# EAGLE design Keypad (EAGLE 6.5.0)
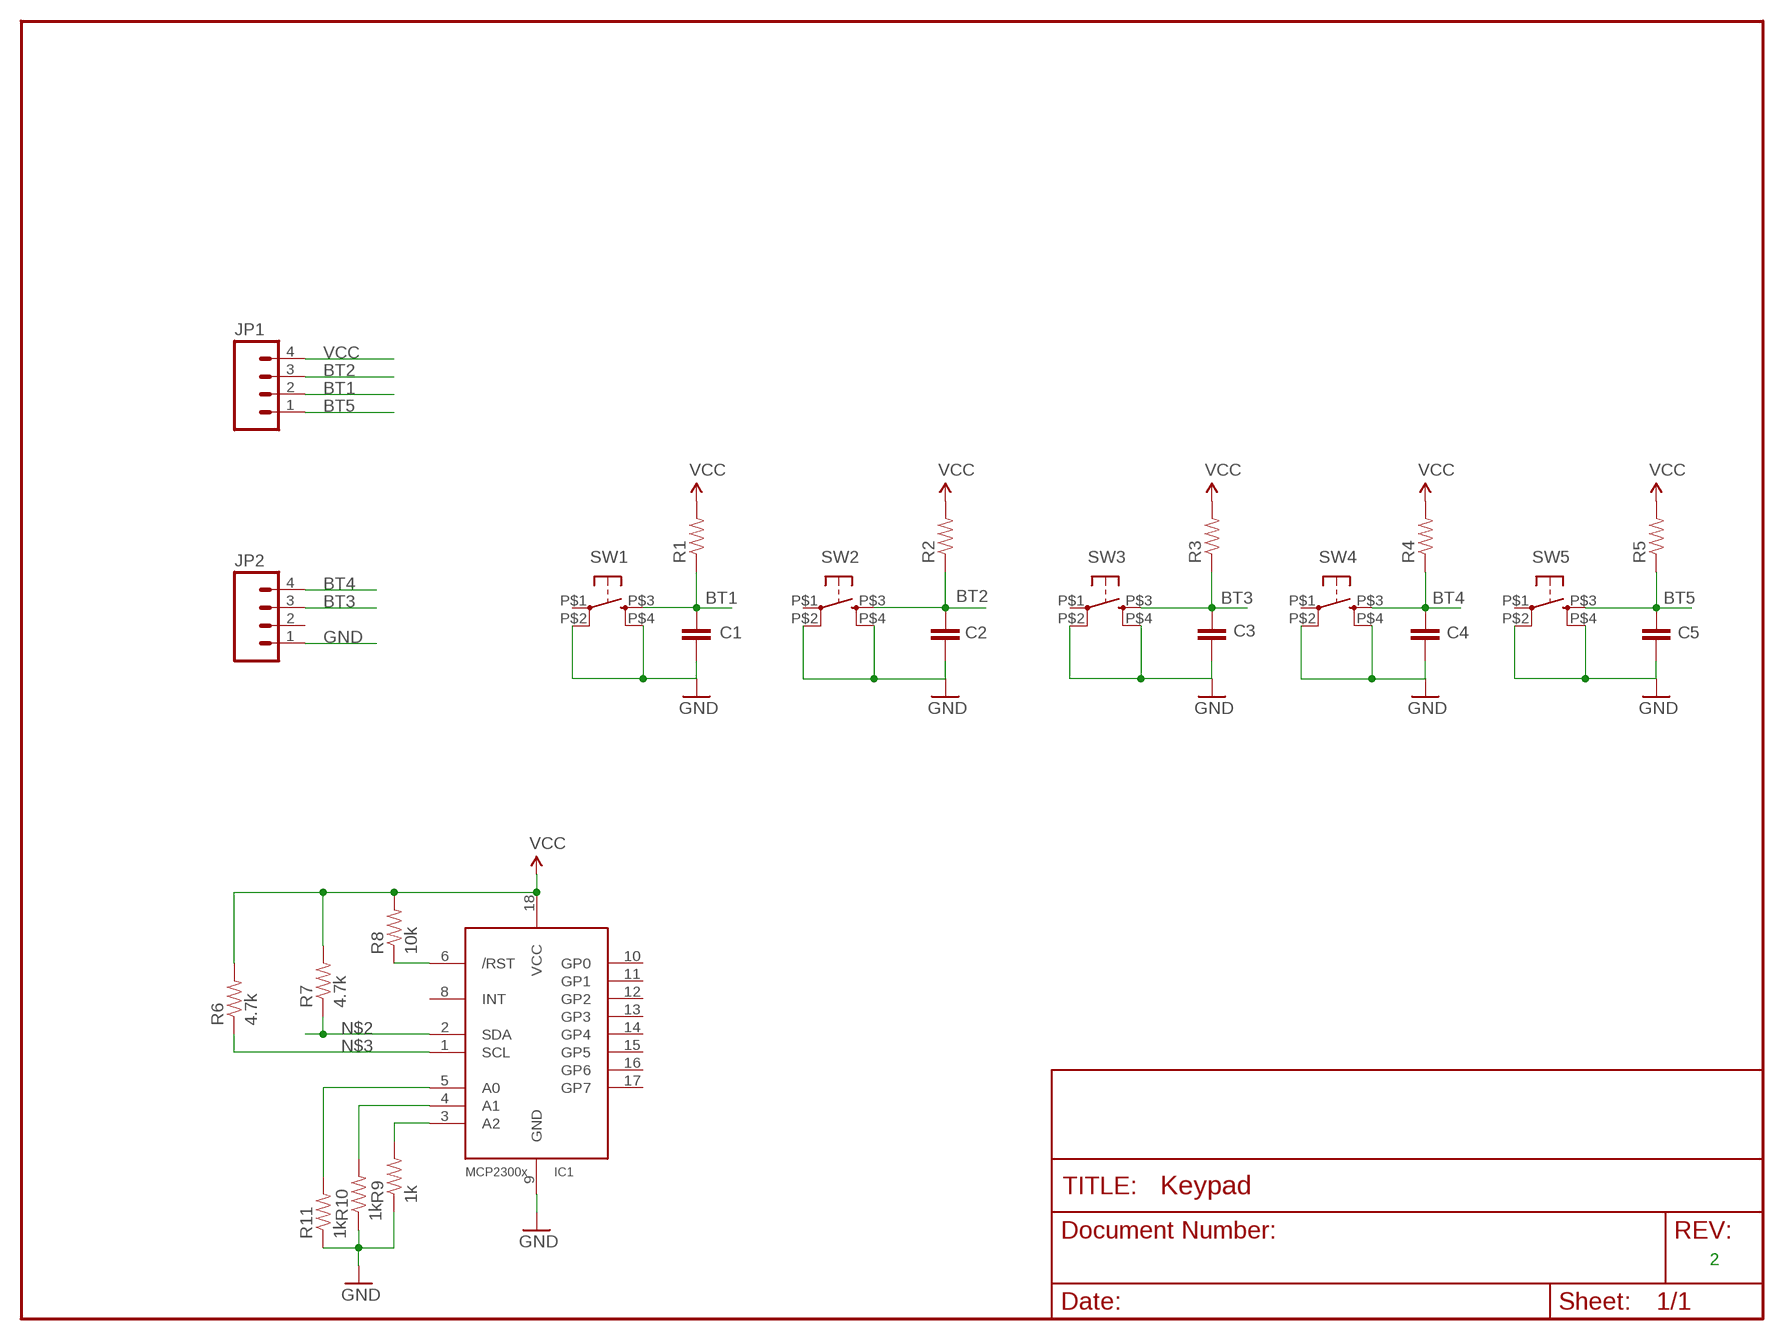
[diagram p0: schematic, sheet 1]

## Parts
C1  CAP1206  [1206]
C2  CAP1206  [1206]
C3  CAP1206  [1206]
C4  CAP1206  [1206]
C5  CAP1206  [1206]
IC1  MCP2300X/SO  [SO18W]
JP1  M04LOCK  [1X04_LOCK]
JP2  M04LOCK  [1X04_LOCK]
R1  RESISTOR1206  [1206]
R2  RESISTOR1206  [1206]
R3  RESISTOR1206  [1206]
R4  RESISTOR1206  [1206]
R5  RESISTOR1206  [1206]
R6  4.7k  RESISTOR1206  [1206]
R7  4.7k  RESISTOR1206  [1206]
R8  10k  RESISTOR1206  [1206]
R9  1k  RESISTOR1206  [1206]
R10  1k  RESISTOR1206  [1206]
R11  1k  RESISTOR1206  [1206]
SW1  TAC_PTH_12MM  [TACTILE-PTH-12MM]
SW2  TAC_PTH_12MM  [TACTILE-PTH-12MM]
SW3  TAC_PTH_12MM  [TACTILE-PTH-12MM]
SW4  TAC_PTH_12MM  [TACTILE-PTH-12MM]
SW5  TAC_PTH_12MM  [TACTILE-PTH-12MM]

## Nets
BT1: C1.1 JP1.2 R1.1 SW1.P$3
BT2: C2.1 JP1.3 R2.1 SW2.P$3
BT3: C3.1 JP2.3 R3.1 SW3.P$3
BT4: C4.1 JP2.4 R4.1 SW4.P$3
BT5: C5.1 JP1.1 R5.1 SW5.P$3
GND: C1.2 C2.2 C3.2 C4.2 C5.2 IC1.9(GND) JP2.1 R9.1 R10.1 R11.1 SW1.P$2 SW1.P$4 SW2.P$2 SW2.P$4 SW3.P$2 SW3.P$4 SW4.P$2 SW4.P$4 SW5.P$2 SW5.P$4
N$2: IC1.2(SDA) R7.1
N$3: IC1.1(SCL) R6.1
N$4: IC1.6(/RST) R8.1
N$7: IC1.3(A2) R9.2
N$8: IC1.4(A1) R10.2
N$9: IC1.5(A0) R11.2
VCC: IC1.18(VCC) JP1.4 R1.2 R2.2 R3.2 R4.2 R5.2 R6.2 R7.2 R8.2
Unconnected: IC1.8(INT) IC1.10(GP0) IC1.11(GP1) IC1.12(GP2) IC1.13(GP3) IC1.14(GP4) IC1.15(GP5) IC1.16(GP6) IC1.17(GP7) JP2.2 SW1.P$1 SW2.P$1 SW3.P$1 SW4.P$1 SW5.P$1

## Notes on the sheet
- 2

## Library data of the parts
C1-C5 = Add-Ohms:CAP: Capacitor Standard 0603 ceramic capacitor, and 0.1" leaded capacitor.
IC1 = adafruit:MCP2300X: MCP23008 Inexpensive i2c i/o expander - 8 general purpose i/o pins with optional pullups
JP1 JP2 = SparkFun:M04: Header 4 Standard 4-pin 0.1" header. Use with straight break away headers (SKU : PRT-00116), right angle break away headers (PRT-00553), swiss pins (PRT-00743), machine pins (PRT-00117), and female headers (PRT-00115). Molex polarized connector foot print use with SKU : PRT-08231 with associated crimp pins and housings. 1MM SMD Version SKU: PRT-10208
R1-R11 = Add-Ohms:RESISTOR: Resistor Basic schematic elements and footprints for 0603, 1206, and PTH resistors.
SW1-SW5 = Add-Ohms:TAC_PTH_12MM

## Board
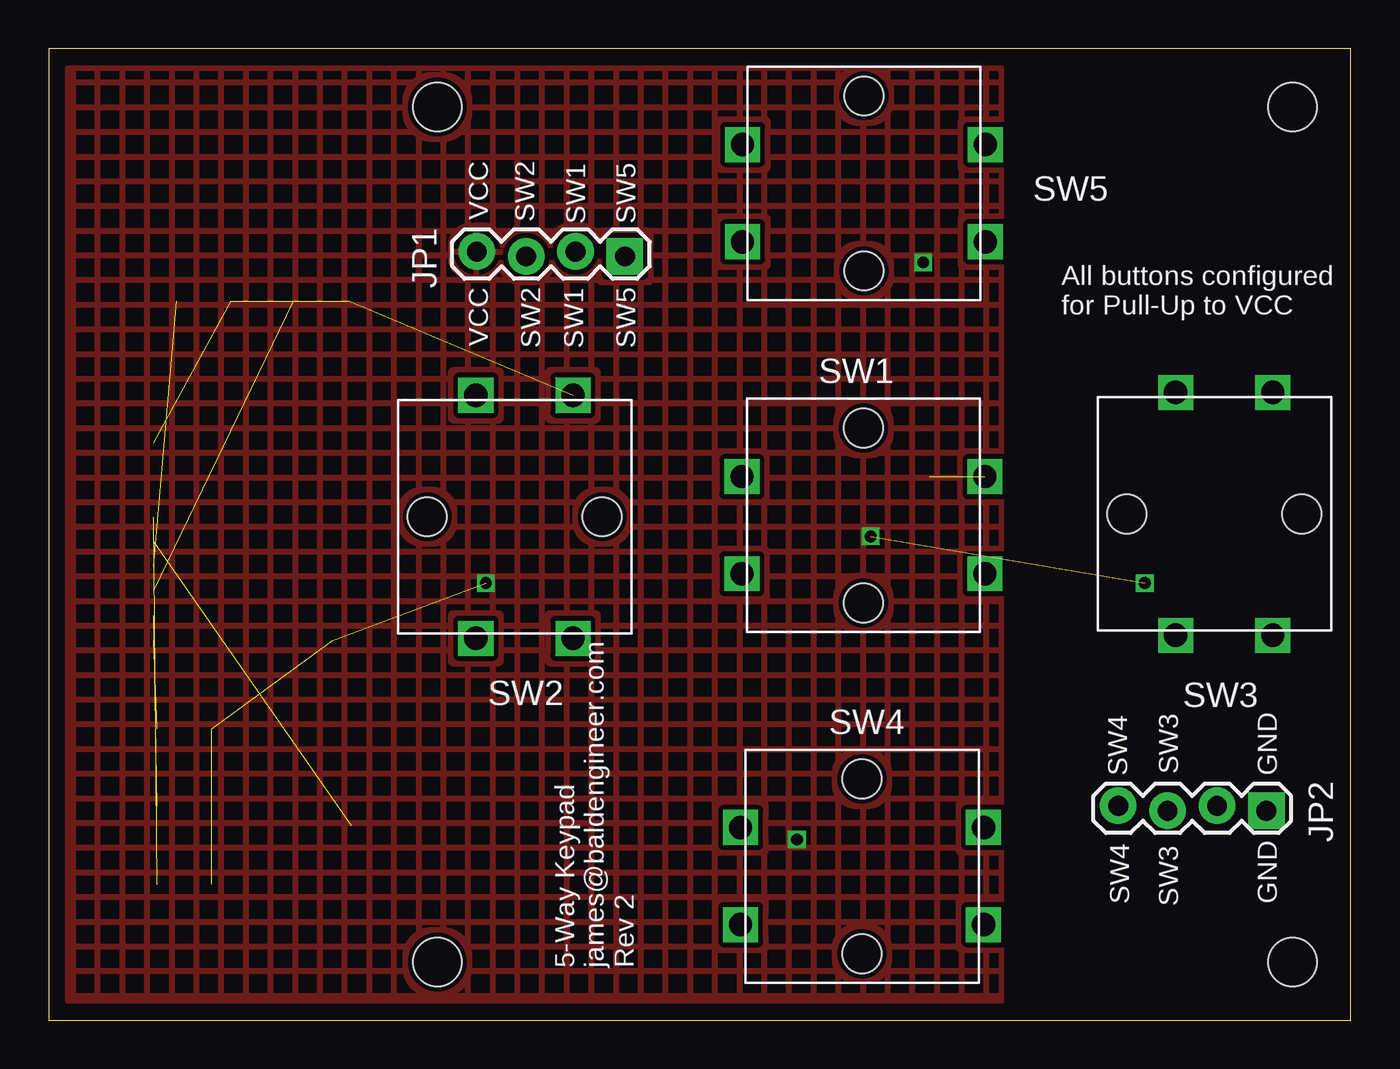
[diagram p1: board, top side]
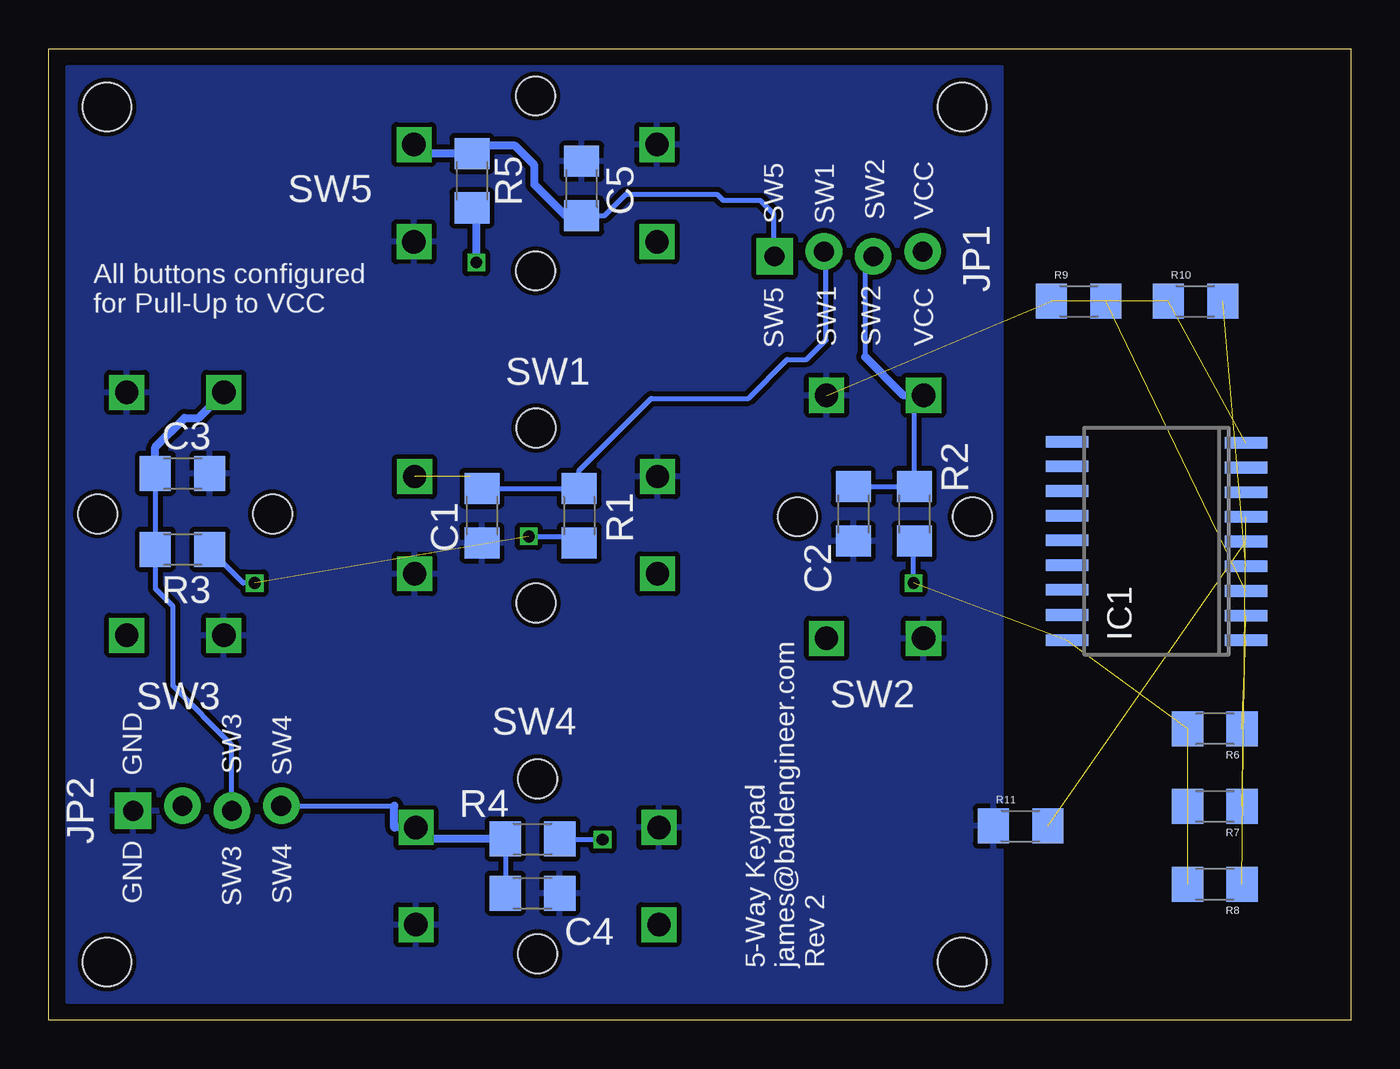
[diagram p2: board, bottom side, seen from below]

Size 67 x 50 mm. Coordinates in mm from the lower left corner, seen from the top.
Outline: 0,0 67,0 67,50 0,50 0,0
Copper layers (1*16): Top 0.035mm / dielectric 1.5mm / Bottom 0.035mm
Design rules "Fusion_eagle_rule_v1.1": minimum track width 6mil, minimum drill 12mil, track to track 6mil, track to pad 6mil, pad to pad 6mil, via to via 6mil, smd to smd 0mil, copper to edge 10mil, drill to drill 10mil, minimum pad ring 10mil, minimum via ring 6mil, stop-mask expansion 2mil, vias tented up to drill 100mil, thermal gap 10mil
Holes 2.5 mm at 20,3 20,47 64,47 64,3

### Footprints (pad centres in the part's own frame; a part is rotated, then mirrored left to right if it is on the bottom)
1206 = smd 1.6 x 1.8: 1 -1.4,0; 2 1.4,0
SO18W = smd 0.6 x 2.2: 1 -4.445,-4.6; 2 -3.175,-4.6; 3 -1.905,-4.6; 4 -0.635,-4.6; 5 0.635,-4.6; 6 1.905,-4.6; 7 3.175,-4.6; 8 4.445,-4.6; 9 5.715,-4.6; 10 5.775,4.6; 11 4.505,4.6; 12 3.235,4.6; 13 1.965,4.6; 14 0.695,4.6; 15 -0.575,4.6; 16 -1.845,4.6; 17 -3.145,4.6; 18 -4.445,4.6
1X04_LOCK = drill 1.016 pad 1.88 square: 1 0,0.127 | drill 1.016 pad 1.88: 2 2.54,-0.127; 3 5.08,0.127; 4 7.62,-0.127
TACTILE-PTH-12MM = drill 1.2 square: P$1 -0.25,3; P$2 -0.25,8; P$3 12.25,8; P$4 12.25,3 | hole 2: 6,10.5; 6,1.5

### Placement (x,y rotation side)
C1  44.71,25.97 270 bottom
C2  25.6,26.06 270 bottom
C3  60.11,28.14 0 bottom
C4  42.1,6.54 0 bottom
C5  39.57,42.8 90 bottom
IC1  10,24 90 bottom
JP1  29.65,39.43 180 top
JP2  62.65,10.91 180 top
R1  39.7,25.97 270 bottom
R2  22.46,26.06 270 bottom
R3  60.11,24.23 0 bottom
R4  42.1,9.33 0 bottom
R5  45.22,43.2 270 bottom
R6  7,15 180 bottom
R7  7,11 180 bottom
R8  7,7 180 bottom
R9  14,37 0 bottom
R10  8,37 0 bottom
R11  17,10 0 bottom
SW1  35.92,19.98 0 top
SW2  29.98,19.91 90 top
SW3  65.98,20.06 90 top
SW4  35.85,1.92 0 top
SW5  35.95,37.06 0 top

### Tracks (layer width: path | path; a pad name or v marks a point on that pad's centre or on a via)
BT1  (1 unrouted)
  Bottom 0.254: 45.32,27.98 C1.1 R1.1 39.7,28.3 36,32 31,32 29,34 28,34 27,35 27,39.45 JP1.2
BT2
  Bottom 0.254: C2.1 R2.1 22.46,31.68 | JP1.3 25,39 25,34.14
  Bottom 0.406: 25,34.14 23.02,32.16 SW2.P$3 22.46,31.68
BT3
  Bottom 0.254: C3.1 R3.1 61.5,22.2 60.6,21.3 60.6,17.2 57.57,14.17 JP2.3
  Bottom 0.406: C3.1 61.51,29.49 60,31 59.29,31 SW3.P$3
BT4
  Bottom 0.254: R4.1 C4.1 | JP2.4 49.22,11.04
  Bottom 0.406: R4.1 48.1,9.33 SW4.P$3 49.22,9.92 49.22,11.04
BT5
  Bottom 0.254: C5.1 38.4,41.4 37.3,42.5 32.6,42.5 32.3,42.2 30.4,42.2 29.7,41.5 29.7,39.35 JP1.1
  Bottom 0.406: C5.1 40.4,41.4 42,43 42,44 43,45 44.82,45 R5.1 47.74,44.6 SW5.P$3
GND  (3 unrouted)
  pour Bottom (isolate 0.254): 18,49 66,49 66,1 18,1
N$2  (1 unrouted)
N$3  (1 unrouted)
N$4  (1 unrouted)
N$7  (1 unrouted)
N$8  (1 unrouted)
N$9  (1 unrouted)
VCC  (via drill 0.6)  (5 unrouted)
  Bottom 0.254: v38.5,9.3 40.67,9.3 R4.2 | v22.5,22.5 22.5,24.62 R2.2 | v42.3,24.9 40.03,24.9 R1.2 | v56.4,22.5 56.98,22.5 R3.2
  Bottom 0.406: R5.2 45,41.8 v45,39
  pour Top (isolate 0.254, hatched): 1,49 49,49 49,1 1,1

### Text on the board
tNames: VCC | SW1 | SW2 | SW5 | VCC | SW1 | All buttons configured / for Pull-Up to VCC | SW2 | SW5 | SW3 | SW4 | GND | SW3 | SW4 | GND | 5-Way Keypad / james@baldengineer.com / Rev 2
bNames: VCC | SW1 | SW5 | JP1 | SW2 | SW5 | VCC | SW1 | All buttons configured / for Pull-Up to VCC | SW2 | SW5 | SW1 | SW2 | SW3 | SW3 | SW4 | SW4 | GND | JP2 | SW3 | SW4 | GND | 5-Way Keypad / james@baldengineer.com / Rev 2